# Altium schematic sheet 8_mixer.SchDoc
size A; SheetNumber: 8; SheetTotal: 10
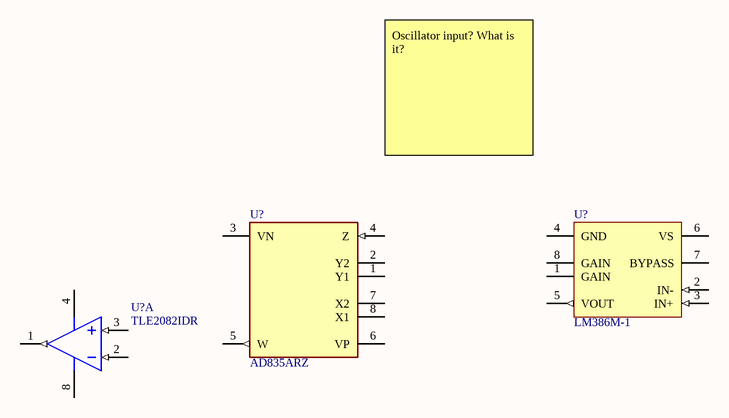
[diagram p0: 8_mixer.SchDoc]

## Parts
(Parts that share a designator on the sheet are numbered #1, #2 ... from top to bottom, then left to right.)
U?#1  LM386M-1  [D0008A_M]
U?#2  AD835ARZ  [FP-R-8-IPC_A]
U?#3  TLE2082IDR  [D0008A_L]  (part A of 2)

## Nets

Not connected (* = marked no-connect by the designer): U?#1 1(GAIN) 2(IN-) 3(IN+) 4(GND) 5(VOUT) 6(VS) 7(BYPASS) 8(GAIN); U?#2 1(Y1) 2(Y2) 3(VN) 4(Z) 5(W) 6(VP) 7(X2) 8(X1); U?#3 1(OUT1) 2(IN1-) 3(IN1+) 4(VCC-) 8(VCC+)

## Notes on the sheet
- Oscillator input? What is it?

## Library data of the parts
U?#1 = CMP-0057-00421-4: Low Voltage Audio Power Amplifier, 8-pin Narrow SOIC; Manufacturer: Texas Instruments; PackageTopMarking: NSZXTT*LM386*M-1; CompType: Audio IC; PowerWise: N; ComponentLink1Description: Datasheet URL; Code_IPC: SOIC127P600-8; PackageDescription: SOIC Narrow, 4.9 x 3.9 x 1.45mm, 8 Lead, 1.27mm Pitch; Code_JEDEC: MS-012-AA; PinCount: 8; ComponentLink1URL: http://www.ti.com/general/docs/lit/getliterature.tsp?genericPartNumber=LM386&fileType=pdf; RoHS: N; PackageReference: D0008A
U?#2 = CMP-09114-000033-1: ANALOG MULTIPLIER OR DIVIDER, 25; Supply Current: 16mA; Max Supply Voltage: 5.5V; Number of Elements: 1; Operating Supply Voltage: 5V; Max Frequency: 250MHz; Slew Rate: 1000V/µs; Output Voltage: 2.5V; Accuracy: 2%; Settling Time: 20ns; Max Power Dissipation: 300mW; Operating Supply Current: 25mA; Min Dual Supply Voltage: 4.5V; Max Input Voltage: 1V; Number of Channels: 2; Number of Amplifiers: 3; Number of Bits: 4; Length: 5mm; Number of Pins: 8; Packaging: Rail/Tube; REACH SVHC: No SVHC; Radiation Hardening: No; Height: 1.5mm; Lead Free: Contains Lead; Series: -; Case/Package: SOIC; Number of Circuits: 1; Contact Plating: Tin; Mount: Surface Mount; Max Operating Temperature: 85°C; Dual Supply Voltage: 5V; Min Operating Temperature: -40°C; Nominal Supply Current: 16mA; Package Quantity: 1; RoHS Compliant: Yes; Max Dual Supply Voltage: 5.5V; Min Supply Voltage: 4.5V; Width: 4mm; -3db Bandwidth: 250MHz
U?#3 = CMP-0272-03029-3: Dual High-Speed JFET-Input Operational Amplifier, 4.5 to 38 V, -40 to 85 degC, 8-pin SOIC (D8), Green (RoHS & no Sb/Br); Manufacturer: Texas Instruments; IIB(Max)(pA): 175; Packing: LARGE T&R; Slew Rate(Typ)(V/us): 35; Offset Drift(Typ)(uV/C): 2.4; Rating: Catalog; Iq per channel(Max)(mA): 1.95; CMRR(Min)(dB): 70; Sub Family: High Output Current Amplifier (>=50mA), High Supply Voltage Amplifier (>=30V), Precision Amplifier; GBW(Typ)(MHz): 9.4; Vio (25C)(Max)(mV): 7; Total Supply Voltage(Min)(+5V is 5, +/-5V is 10): 4.5; Number of Channels: 2; Total Supply Voltage(Max)(+5V is 5, +/-5V is 10): 38; PackageDescription: 8-Pin Plastic Small Outline, Body 4.9 x 3.9 mm, Pitch 1.27 mm; PartNumber: TLE2082IDR; ComponentLink1URL: http://www.ti.com/; Code_JEDEC: MS-012; DatasheetVersion: SLOS182B; ComponentLink1Description: Manufacturer URL; PackageVersion: 4040047-3/M, 06/2011; ComponentLink2Description: Datasheet; PackageReference: D0008A; ComponentLink2URL: http://www.ti.com/lit/ds/symlink/tle2082.pdf; ComponentLink3URL: http://www.ti.com/litv/pdf/msoi002j; Mounting Technology: Surface Mount; ComponentLink3Description: Package Specification; Eco-Plan: Green (RoHS & no Sb/Br)